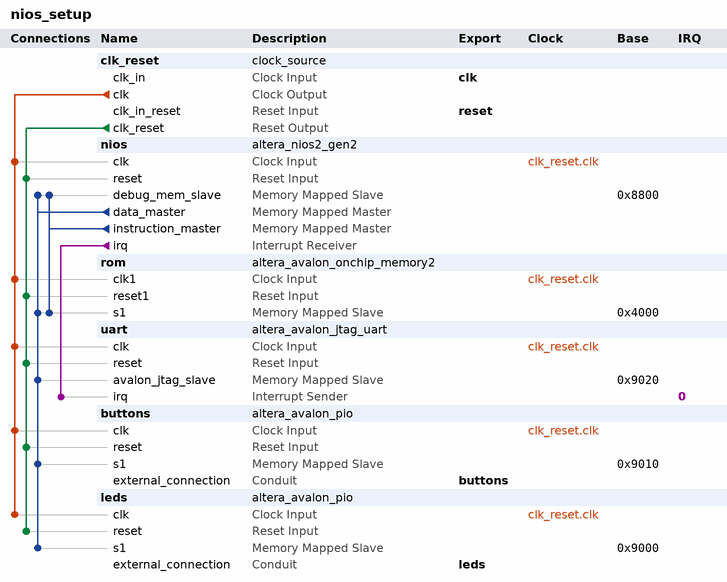
[diagram p0: system contents]
# Platform Designer (Qsys) system nios_setup, Cyclone 10 LP 10CL006YE144A7G
# Parameters at their usual value, and those the tool derives, are not listed.
package require -exact qsys 18.0
create_system nios_setup
set_project_property DEVICE_FAMILY {Cyclone 10 LP}
set_project_property DEVICE 10CL006YE144A7G

add_instance clk_reset clock_source 18.0
set_instance_parameter_value clk_reset clockFrequency 50000000

add_instance nios altera_nios2_gen2 18.0
set_instance_parameter_value nios dcache_size 2048
set_instance_parameter_value nios exceptionSlave rom.s1
set_instance_parameter_value nios icache_size 4096
set_instance_parameter_value nios impl Tiny
set_instance_parameter_value nios resetSlave rom.s1

add_instance rom altera_avalon_onchip_memory2 18.0
set_instance_parameter_value rom dataWidth 32
set_instance_parameter_value rom dualPort false
set_instance_parameter_value rom initMemContent true
set_instance_parameter_value rom initializationFileName nios_setup_rom.hex
set_instance_parameter_value rom memorySize 16384
set_instance_parameter_value rom useNonDefaultInitFile true

add_instance uart altera_avalon_jtag_uart 18.0
set_instance_parameter_value uart simInteractiveOptions NO_INTERACTIVE_WINDOWS

add_instance buttons altera_avalon_pio 18.0
set_instance_parameter_value buttons direction Input
set_instance_parameter_value buttons width 2

add_instance leds altera_avalon_pio 18.0
set_instance_parameter_value leds direction Output
set_instance_parameter_value leds width 2

# connections
add_connection clk_reset.clk buttons.clk clock
add_connection clk_reset.clk leds.clk clock
add_connection clk_reset.clk nios.clk clock
add_connection clk_reset.clk rom.clk1 clock
add_connection clk_reset.clk uart.clk clock
add_connection clk_reset.clk_reset buttons.reset reset
add_connection clk_reset.clk_reset leds.reset reset
add_connection clk_reset.clk_reset nios.reset reset
add_connection clk_reset.clk_reset rom.reset1 reset
add_connection clk_reset.clk_reset uart.reset reset
add_connection nios.data_master buttons.s1 avalon
set_connection_parameter_value nios.data_master/buttons.s1 baseAddress 0x9010
add_connection nios.data_master leds.s1 avalon
set_connection_parameter_value nios.data_master/leds.s1 baseAddress 0x9000
add_connection nios.data_master nios.debug_mem_slave avalon
set_connection_parameter_value nios.data_master/nios.debug_mem_slave baseAddress 0x8800
add_connection nios.data_master rom.s1 avalon
set_connection_parameter_value nios.data_master/rom.s1 baseAddress 0x4000
add_connection nios.data_master uart.avalon_jtag_slave avalon
set_connection_parameter_value nios.data_master/uart.avalon_jtag_slave baseAddress 0x9020
add_connection nios.instruction_master nios.debug_mem_slave avalon
set_connection_parameter_value nios.instruction_master/nios.debug_mem_slave baseAddress 0x8800
add_connection nios.instruction_master rom.s1 avalon
set_connection_parameter_value nios.instruction_master/rom.s1 baseAddress 0x4000
add_connection nios.irq uart.irq interrupt
set_connection_parameter_value nios.irq/uart.irq irqNumber 0

# exported interfaces
add_interface buttons conduit end
set_interface_property buttons EXPORT_OF buttons.external_connection
add_interface clk clock sink
set_interface_property clk EXPORT_OF clk_reset.clk_in
add_interface leds conduit end
set_interface_property leds EXPORT_OF leds.external_connection
add_interface reset reset sink
set_interface_property reset EXPORT_OF clk_reset.clk_in_reset

set_interconnect_requirement {$system} qsys_mm.clockCrossingAdapter HANDSHAKE
set_interconnect_requirement {$system} qsys_mm.enableEccProtection FALSE
set_interconnect_requirement {$system} qsys_mm.insertDefaultSlave FALSE
set_interconnect_requirement {$system} qsys_mm.maxAdditionalLatency 1

save_system nios_setup.qsys
